# Altium schematic sheet CH340.schdoc
size 90 x 60 mm
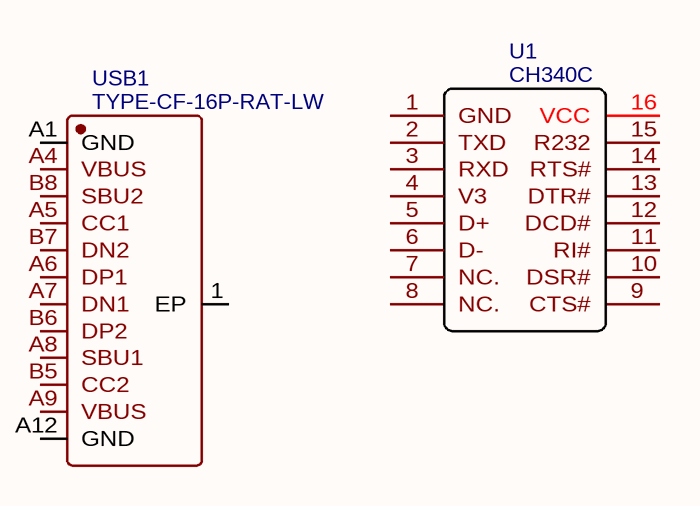
[diagram p0: CH340.schdoc]

## Parts
U1  CH340C  [SOP-16_L10.0-W3.9-P1.27-LS6.0-BL]
USB1  TYPE-CF-16P-RAT-LW  [TYPE-C-SMD_TYPE-CF-16P-RAT-LW]

## Nets

Not connected (* = marked no-connect by the designer): U1 1(GND) 2(TXD) 3(RXD) 4(V3) 5(D+) 6(D-) 7(NC.) 8(NC.) 9(CTS#) 10(DSR#) 11(RI#) 12(DCD#) 13(DTR#) 14(RTS#) 15(R232) 16(VCC); USB1 1(EP) A1(GND) A4(VBUS) A5(CC1) A6(DP1) A7(DN1) A8(SBU1) A9(VBUS) A12(GND) B5(CC2) B6(DP2) B7(DN2) B8(SBU2)

## Library data of the parts
U1 = CH340C: BOM_Manufacturer: WCH(南京沁恒); BOM_Supplier: LCSC; BOM_Manufacturer Part: CH340C; BOM_Supplier Part: C84681; BOM_JLCPCB Part Class: Extended Part; spicePre: U; spiceSymbolName: CH340C
USB1 = TYPE-CF-16P-RAT-LW: BOM_Manufacturer: null; Contributor: lcsc; BOM_Supplier: LCSC; BOM_Supplier Part: C9900026770; BOM_Manufacturer Part: TYPE-CF-16P-RAT-LW; link: https://atta.szlcsc.comnull; spicePre: U; spiceSymbolName: TYPE-CF-16P-RAT-LW